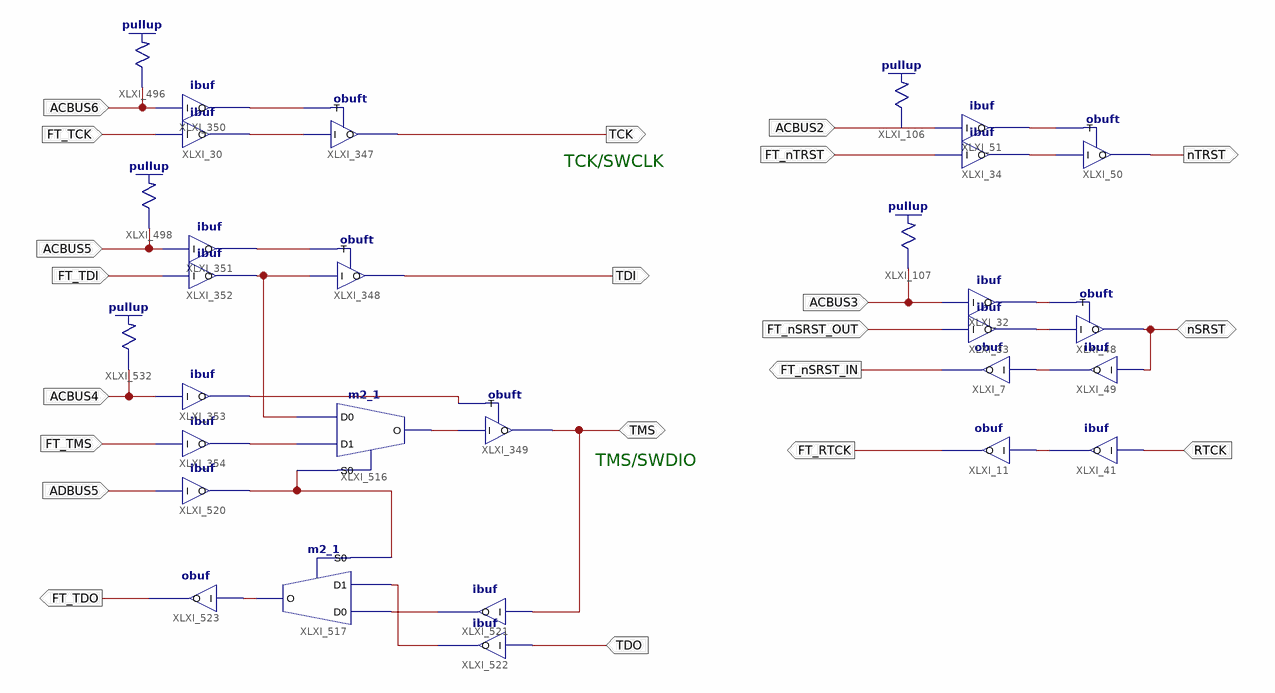
[diagram p0: schematic sheet 1]
// Xilinx ISE schematic BBv2KTLINK.sch (xbr) as structural Verilog: 30 symbols, 21 ports
module BBv2KTLINK (
  input  FT_nTRST,
  input  ACBUS2,
  input  FT_nSRST_OUT,
  input  ACBUS3,
  input  RTCK,
  input  FT_TCK,
  input  ACBUS6,
  input  ACBUS5,
  input  FT_TMS,
  input  ADBUS5,
  input  TDO,
  input  ACBUS4,
  input  FT_TDI,
  inout  nSRST,
  inout  TMS,
  output nTRST,
  output FT_nSRST_IN,
  output FT_RTCK,
  output TCK,
  output TDI,
  output FT_TDO
);

  wire XLXN_47, XLXN_48, XLXN_50, XLXN_52, XLXN_55, XLXN_61, XLXN_261, XLXN_262, XLXN_266, XLXN_435,
       XLXN_437, XLXN_439, XLXN_440, XLXN_442, XLXN_443, XLXN_444, XLXN_506;

  obuft XLXI_50 (.I(XLXN_52), .T(XLXN_61), .O(nTRST));
  ibuf XLXI_34 (.I(FT_nTRST), .O(XLXN_52));
  ibuf XLXI_51 (.I(ACBUS2), .O(XLXN_61));
  \pullup  XLXI_106 (.O(ACBUS2));
  \pullup  XLXI_107 (.O(ACBUS3));
  obuf XLXI_7 (.I(XLXN_50), .O(FT_nSRST_IN));
  ibuf XLXI_33 (.I(FT_nSRST_OUT), .O(XLXN_48));
  ibuf XLXI_32 (.I(ACBUS3), .O(XLXN_47));
  obuft XLXI_48 (.I(XLXN_48), .T(XLXN_47), .O(nSRST));
  ibuf XLXI_49 (.I(nSRST), .O(XLXN_50));
  obuf XLXI_11 (.I(XLXN_55), .O(FT_RTCK));
  ibuf XLXI_41 (.I(RTCK), .O(XLXN_55));
  ibuf XLXI_30 (.I(FT_TCK), .O(XLXN_261));
  obuft XLXI_347 (.I(XLXN_261), .T(XLXN_262), .O(TCK));
  ibuf XLXI_350 (.I(ACBUS6), .O(XLXN_262));
  ibuf XLXI_351 (.I(ACBUS5), .O(XLXN_266));
  ibuf XLXI_352 (.I(FT_TDI), .O(XLXN_506));
  \pullup  XLXI_498 (.O(ACBUS5));
  obuft XLXI_349 (.I(XLXN_435), .T(XLXN_437), .O(TMS));
  obuft XLXI_348 (.I(XLXN_506), .T(XLXN_266), .O(TDI));
  m2_1 XLXI_516 (.D0(XLXN_506), .D1(XLXN_439), .S0(XLXN_440), .O(XLXN_435));
  ibuf XLXI_354 (.I(FT_TMS), .O(XLXN_439));
  m2_1 XLXI_517 (.D0(XLXN_442), .D1(XLXN_443), .S0(XLXN_440), .O(XLXN_444));
  obuf XLXI_523 (.I(XLXN_444), .O(FT_TDO));
  \pullup  XLXI_496 (.O(ACBUS6));
  ibuf XLXI_522 (.I(TDO), .O(XLXN_443));
  ibuf XLXI_521 (.I(TMS), .O(XLXN_442));
  \pullup  XLXI_532 (.O(ACBUS4));
  ibuf XLXI_353 (.I(ACBUS4), .O(XLXN_437));
  ibuf XLXI_520 (.I(ADBUS5), .O(XLXN_440));

  // Notes on the sheet:
  //   TCK/SWCLK
  //   TMS/SWDIO
endmodule
